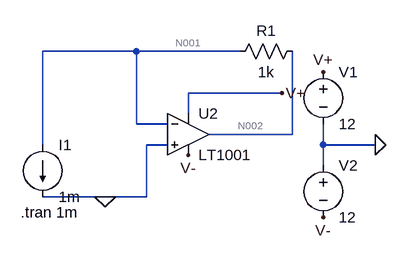
[diagram p0: schematic Draft22.asc]
Draft22.asc, the LTspice schematic file:
Version 4
SHEET 1 880 680
WIRE 128 32 -16 32
WIRE 288 32 128 32
WIRE 352 96 208 96
WIRE 208 128 208 96
WIRE 128 144 128 32
WIRE 176 144 128 144
WIRE 368 160 368 32
WIRE 368 160 240 160
WIRE -16 176 -16 32
WIRE 176 176 144 176
WIRE 416 176 416 144
WIRE 496 176 416 176
WIRE 416 208 416 176
WIRE 80 256 -16 256
WIRE 144 256 144 176
WIRE 144 256 80 256
FLAG 80 256 0
FLAG 352 96 V+
FLAG 416 64 V+
FLAG 416 288 V-
FLAG 208 192 V-
FLAG 496 176 0
SYMBOL current -16 176 R0
WINDOW 123 0 0 Left 2
WINDOW 39 0 0 Left 2
SYMATTR InstName I1
SYMATTR Value 1m
SYMBOL res 384 16 R90
WINDOW 0 0 56 VBottom 2
WINDOW 3 32 56 VTop 2
SYMATTR InstName R1
SYMATTR Value 1k
SYMBOL voltage 416 48 R0
SYMATTR InstName V1
SYMATTR Value 12
SYMBOL voltage 416 192 R0
SYMATTR InstName V2
SYMATTR Value 12
SYMBOL Opamps\\LT1001 208 96 R0
SYMATTR InstName U2
TEXT -50 280 Left 2 !.tran 1m

The netlist it stands for:
* Draft22.asc
I1 N001 0 1m
R1 N002 N001 1k
V1 V+ 0 12
V2 0 V- 12
XU2 0 N001 V+ V- N002 LT1001  ; pins In+ In- V+ V- OUT
.tran 1m
.lib LTC.lib
.backanno
.end

* Results of the author's LTspice run, read from the files saved beside the schematic
* Operating Point, zero values left out:
*   V(n001) = -1.385 µV
*   V(n002) = 1 V
*   V(v+) = 12 V
*   V(v-) = -12 V
*   I(I1) = 1 mA
*   I(R1) = 1 mA
*   I(V2) = -1.778 mA
*   I(V1) = -2.778 mA
*   Ix(u2:3) = 2.778 mA
*   Ix(u2:4) = -1.778 mA
*   Ix(u2:5) = -1 mA